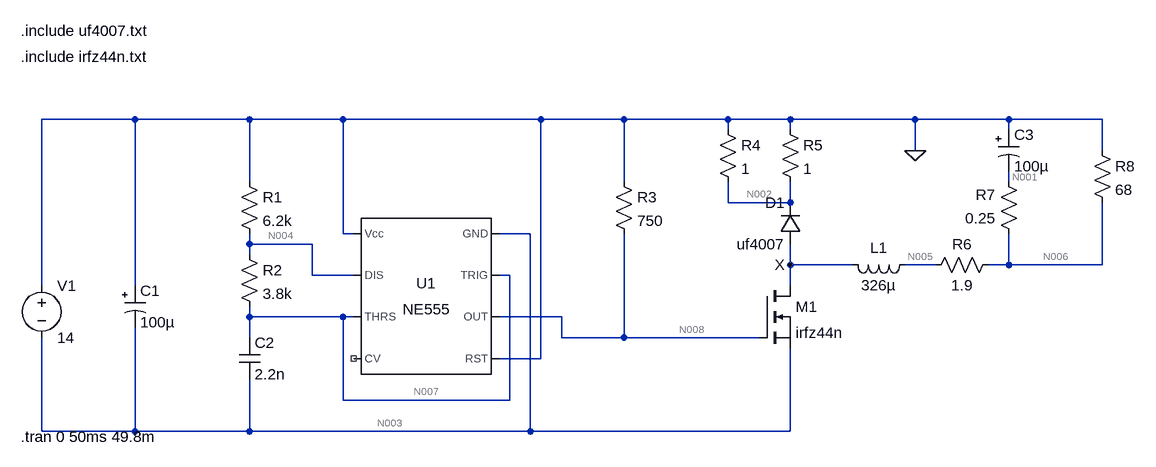
[diagram p0: schematic BuckConverter.asc]
BuckConverter.asc, the LTspice schematic file:
Version 4
SHEET 1 1204 680
WIRE -352 -144 -496 -144
WIRE -176 -144 -352 -144
WIRE -32 -144 -176 -144
WIRE 272 -144 -32 -144
WIRE 400 -144 272 -144
WIRE 560 -144 400 -144
WIRE 656 -144 560 -144
WIRE 848 -144 656 -144
WIRE 992 -144 848 -144
WIRE 1136 -144 992 -144
WIRE 560 -128 560 -144
WIRE 656 -128 656 -144
WIRE 992 -128 992 -144
WIRE 848 -96 848 -144
WIRE 1136 -96 1136 -144
WIRE -176 -48 -176 -144
WIRE 400 -48 400 -144
WIRE 992 -48 992 -64
WIRE 560 -16 560 -48
WIRE 656 -16 656 -48
WIRE 656 -16 560 -16
WIRE -32 32 -32 -144
WIRE -16 32 -32 32
WIRE 256 32 208 32
WIRE -176 48 -176 32
WIRE -80 48 -176 48
WIRE -176 64 -176 48
WIRE 656 80 656 48
WIRE 752 80 656 80
WIRE 880 80 832 80
WIRE 992 80 992 32
WIRE 992 80 960 80
WIRE 1136 80 1136 -16
WIRE 1136 80 992 80
WIRE -80 96 -80 48
WIRE -16 96 -80 96
WIRE 224 96 208 96
WIRE -496 112 -496 -144
WIRE -352 112 -352 -144
WIRE 656 112 656 80
WIRE -176 160 -176 144
WIRE -32 160 -176 160
WIRE -16 160 -32 160
WIRE 304 160 208 160
WIRE -176 192 -176 160
WIRE 304 192 304 160
WIRE 400 192 400 32
WIRE 400 192 304 192
WIRE 608 192 400 192
WIRE 272 224 272 -144
WIRE 272 224 208 224
WIRE -32 288 -32 160
WIRE 224 288 224 96
WIRE 224 288 -32 288
WIRE -496 336 -496 192
WIRE -352 336 -352 176
WIRE -352 336 -496 336
WIRE -176 336 -176 256
WIRE -176 336 -352 336
WIRE 256 336 256 32
WIRE 256 336 -176 336
WIRE 656 336 656 208
WIRE 656 336 256 336
FLAG 848 -96 0
FLAG 656 80 X
SYMBOL Misc\\NE555 96 128 M0
SYMATTR InstName U1
SYMBOL voltage -496 96 R0
WINDOW 123 0 0 Left 0
WINDOW 39 0 0 Left 0
SYMATTR InstName V1
SYMATTR Value 14
SYMBOL polcap -368 112 R0
WINDOW 3 24 56 Left 2
SYMATTR Value 100µ
SYMATTR InstName C1
SYMATTR Description Capacitor
SYMATTR Type cap
SYMATTR SpiceLine V=2 Irms=3 Rser=0.006 Lser=0 mfg="Rubycon" pn="2SLE100M" type="Al electrolytic"
SYMBOL res -192 -64 R0
SYMATTR InstName R1
SYMATTR Value 6.2k
SYMBOL res -192 48 R0
SYMATTR InstName R2
SYMATTR Value 3.8k
SYMBOL cap -192 192 R0
SYMATTR InstName C2
SYMATTR Value 2.2n
SYMBOL res 384 -64 R0
SYMATTR InstName R3
SYMATTR Value 750
SYMBOL res 544 -144 R0
SYMATTR InstName R4
SYMATTR Value 1
SYMBOL res 640 -144 R0
SYMATTR InstName R5
SYMATTR Value 1
SYMBOL diode 672 48 R180
WINDOW 0 24 64 Left 2
WINDOW 3 24 0 Left 2
SYMATTR InstName D1
SYMATTR Value uf4007
SYMBOL ind 848 64 R90
WINDOW 0 5 56 VBottom 2
WINDOW 3 32 56 VTop 2
SYMATTR InstName L1
SYMATTR Value 326µ
SYMBOL res 976 64 R90
WINDOW 0 0 56 VBottom 2
WINDOW 3 32 56 VTop 2
SYMATTR InstName R6
SYMATTR Value 1.9
SYMBOL res 1008 48 R180
WINDOW 0 36 76 Left 2
WINDOW 3 36 40 Left 2
SYMATTR InstName R7
SYMATTR Value 0.25
SYMBOL polcap 976 -128 R0
WINDOW 3 24 56 Left 2
SYMATTR Value 100µ
SYMATTR InstName C3
SYMATTR Description Capacitor
SYMATTR Type cap
SYMATTR SpiceLine V=2 Irms=3 Rser=0.006 Lser=0 mfg="Rubycon" pn="2SLE100M" type="Al electrolytic"
SYMBOL res 1120 -112 R0
SYMATTR InstName R8
SYMATTR Value 68
SYMBOL nmos 608 112 R0
SYMATTR InstName M1
SYMATTR Value irfz44n
TEXT -528 -280 Left 2 !.include uf4007.txt
TEXT -528 -240 Left 2 !.include irfz44n.txt
TEXT -528 344 Left 2 !.tran 0 50ms 49.8m

The netlist it stands for:
* BuckConverter.asc
XU1 N003 N007 N008 0 NC_01 N007 N004 0 NE555  ; pins GND TRIG OUT RST CV THRS DIS Vcc
V1 0 N003 14
C1 0 N003 100µ V=2 Irms=3 Rser=0.006 Lser=0 mfg="Rubycon" pn="2SLE100M" type="Al electrolytic"
R1 0 N004 6.2k
R2 N004 N007 3.8k
C2 N007 N003 2.2n
R3 0 N008 750
R4 0 N002 1
R5 0 N002 1
D1 X N002 uf4007
L1 N005 X 326µ
R6 N006 N005 1.9
R7 N006 N001 0.25
C3 0 N001 100µ V=2 Irms=3 Rser=0.006 Lser=0 mfg="Rubycon" pn="2SLE100M" type="Al electrolytic"
R8 0 N006 68
M1 X N008 N003 N003 irfz44n
.model D D
.lib standard.dio
.model NMOS NMOS
.model PMOS PMOS
.lib standard.mos
.include uf4007.txt
.include irfz44n.txt
.tran 0 50ms 49.8m
.lib NE555.sub
.backanno
.end

* Results of the author's LTspice run, read from the files saved beside the schematic
* Operating Point, zero values left out:
*   V(n007) = -395.8 µV
*   V(n003) = -14 V
*   V(n004) = -289.4 µV
*   V(n008) = -83.33 µV
*   V(n002) = -1.644 µV
*   V(x) = -14 V
*   V(n005) = -14 V
*   V(n006) = -13.62 V
*   V(n001) = -13.62 V
*   Id(M1) = 200.3 mA
*   Is(M1) = -200.3 mA
*   I(D1) = -3.288 µA
*   I(L1) = 200.3 mA
*   I(R1) = 46.68 nA
*   I(R2) = 28 nA
*   I(R3) = 111.1 nA
*   I(R4) = 1.644 µA
*   I(R5) = 1.644 µA
*   I(R6) = 200.3 mA
*   I(R8) = 200.3 mA
*   I(V1) = -204.8 mA
*   Ix(u1:1) = -4.53 mA
*   Ix(u1:2) = 14 nA
*   Ix(u1:3) = 111.1 nA
*   Ix(u1:4) = 82.67 µA
*   Ix(u1:6) = 14 nA
*   Ix(u1:7) = 18.68 nA
*   Ix(u1:8) = 4.447 mA
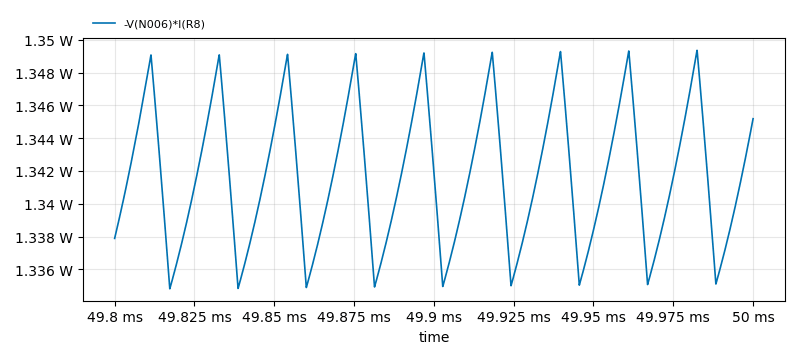
[diagram p1: Transient Analysis of BuckConverter.asc, plotted from the saved traces]
* Transient Analysis, 1 run:
*   -V(N006)*I(R8): min 1.335 W, max 1.349 W, average 1.342 W, rms 1.342 W, last 1.345 W